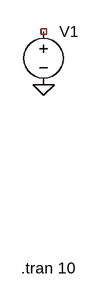
[diagram p0: schematic Draft1.asc]
Draft1.asc, the LTspice schematic file:
Version 4
SHEET 1 880 680
FLAG 144 160 0
SYMBOL voltage 144 64 R0
WINDOW 3 24 96 Invisible 2
WINDOW 123 0 0 Left 0
WINDOW 39 0 0 Left 0
SYMATTR InstName V1
SYMATTR Value PULSE(0 5 0 0s 0s 2.5s 5s 10)
TEXT 110 436 Left 2 !.tran 10

The netlist it stands for:
* Draft1.asc
V1 NC_01 0 PULSE(0 5 0 0s 0s 2.5s 5s 10)
.tran 10
.backanno
.end